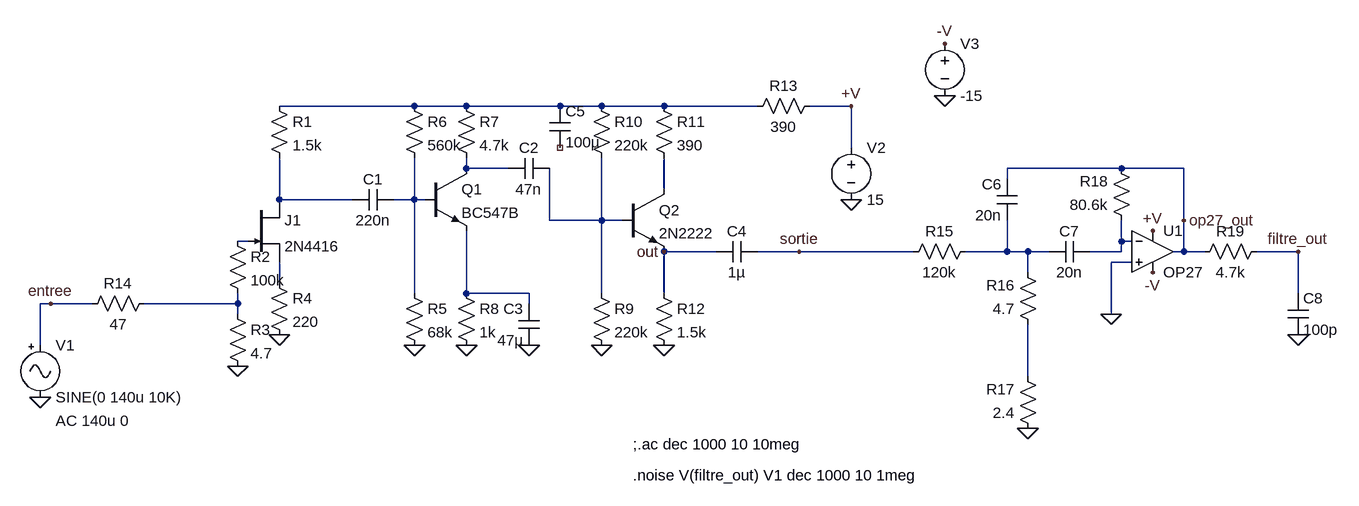
[diagram p0: schematic TP4Elec2.asc]
TP4Elec2.asc, the LTspice schematic file:
Version 4
SHEET 1 1640 680
WIRE 208 0 0 0
WIRE 288 0 208 0
WIRE 432 0 288 0
WIRE 496 0 432 0
WIRE 592 0 496 0
WIRE 736 0 592 0
WIRE 880 0 816 0
WIRE 880 64 880 0
WIRE 288 96 288 80
WIRE 352 96 288 96
WIRE 1296 96 1120 96
WIRE 1392 96 1296 96
WIRE 1120 112 1120 96
WIRE 592 128 592 80
WIRE 0 144 0 80
WIRE 112 144 0 144
WIRE 208 144 208 80
WIRE 208 144 176 144
WIRE 224 144 208 144
WIRE 416 176 416 96
WIRE 496 176 496 80
WIRE 496 176 416 176
WIRE 528 176 496 176
WIRE 1392 176 1392 96
WIRE -48 208 -64 208
WIRE 1296 208 1296 176
WIRE 1312 208 1296 208
WIRE 672 224 592 224
WIRE 800 224 736 224
WIRE 976 224 800 224
WIRE 1120 224 1120 176
WIRE 1120 224 1056 224
WIRE 1152 224 1120 224
WIRE 1184 224 1152 224
WIRE 1296 224 1296 208
WIRE 1296 224 1248 224
WIRE 1392 224 1392 176
WIRE 1392 224 1376 224
WIRE 1424 224 1392 224
WIRE 1568 224 1504 224
WIRE 1312 240 1280 240
WIRE 1152 256 1152 224
WIRE 0 272 0 240
WIRE 208 288 208 144
WIRE 288 288 288 192
WIRE 384 288 288 288
WIRE 496 288 496 176
WIRE 592 288 592 224
WIRE 1568 288 1568 224
WIRE -352 304 -368 304
WIRE -288 304 -352 304
WIRE -64 304 -64 288
WIRE -64 304 -208 304
WIRE 384 304 384 288
WIRE -64 320 -64 304
WIRE 1280 320 1280 240
WIRE -368 368 -368 304
WIRE 1152 416 1152 336
FLAG -368 448 0
FLAG -64 400 0
FLAG 0 352 0
FLAG 208 368 0
FLAG 288 368 0
FLAG 384 368 0
FLAG 496 368 0
FLAG 592 368 0
FLAG 880 144 0
FLAG -352 304 entree
FLAG 800 224 sortie
FLAG 592 224 out
FLAG 1280 320 0
FLAG 1152 496 0
FLAG 1568 352 0
FLAG 1024 -16 0
FLAG 1024 -96 -V
FLAG 880 0 +V
FLAG 1568 224 filtre_out
FLAG 1392 176 op27_out
FLAG 1344 256 -V
FLAG 1344 192 +V
SYMBOL res -16 -16 R0
SYMATTR InstName R1
SYMATTR Value 1.5k
SYMBOL res -80 192 R0
SYMATTR InstName R2
SYMATTR Value 100k
SYMBOL res -80 304 R0
SYMATTR InstName R3
SYMATTR Value 4.7
SYMBOL res -16 256 R0
SYMATTR InstName R4
SYMATTR Value 220
SYMBOL res 192 272 R0
SYMATTR InstName R5
SYMATTR Value 68k
SYMBOL res 192 -16 R0
SYMATTR InstName R6
SYMATTR Value 560k
SYMBOL res 272 -16 R0
SYMATTR InstName R7
SYMATTR Value 4.7k
SYMBOL res 272 272 R0
SYMATTR InstName R8
SYMATTR Value 1k
SYMBOL res 480 272 R0
SYMATTR InstName R9
SYMATTR Value 220k
SYMBOL res 480 -16 R0
SYMATTR InstName R10
SYMATTR Value 220k
SYMBOL res 576 -16 R0
SYMATTR InstName R11
SYMATTR Value 390
SYMBOL res 576 272 R0
SYMATTR InstName R12
SYMATTR Value 1.5k
SYMBOL res 832 -16 R90
WINDOW 0 0 56 VBottom 2
WINDOW 3 32 56 VTop 2
SYMATTR InstName R13
SYMATTR Value 390
SYMBOL res -192 288 R90
WINDOW 0 0 56 VBottom 2
WINDOW 3 32 56 VTop 2
SYMATTR InstName R14
SYMATTR Value 47
SYMBOL cap 176 128 R90
WINDOW 0 0 32 VBottom 2
WINDOW 3 32 32 VTop 2
SYMATTR InstName C1
SYMATTR Value 220n
SYMBOL cap 416 80 R90
WINDOW 0 0 32 VBottom 2
WINDOW 3 32 32 VTop 2
SYMATTR InstName C2
SYMATTR Value 47n
SYMBOL cap 400 368 R180
WINDOW 0 24 56 Left 2
WINDOW 3 24 8 Left 2
SYMATTR InstName C3
SYMATTR Value 47µ
SYMBOL cap 672 240 R270
WINDOW 0 32 32 VTop 2
WINDOW 3 0 32 VBottom 2
SYMATTR InstName C4
SYMATTR Value 1µ
SYMBOL cap 416 0 R0
SYMATTR InstName C5
SYMATTR Value 100µ
SYMBOL Misc\\signal -368 352 R0
WINDOW 123 24 132 Left 2
WINDOW 39 0 0 Left 0
SYMATTR InstName V1
SYMATTR Value SINE(0 140u 10K)
SYMATTR Value2 AC 140u 0
SYMBOL voltage 880 48 R0
WINDOW 123 0 0 Left 0
WINDOW 39 0 0 Left 0
SYMATTR InstName V2
SYMATTR Value 15
SYMBOL njf -48 144 R0
SYMATTR InstName J1
SYMATTR Value 2N4416
SYMBOL npn 224 96 R0
SYMATTR InstName Q1
SYMATTR Value BC547B
SYMBOL npn 528 128 R0
SYMATTR InstName Q2
SYMATTR Value 2N2222
SYMBOL res 1072 208 R90
WINDOW 0 0 56 VBottom 2
WINDOW 3 32 56 VTop 2
SYMATTR InstName R15
SYMATTR Value 120k
SYMBOL res 1168 352 R180
WINDOW 0 36 76 Left 2
WINDOW 3 36 40 Left 2
SYMATTR InstName R16
SYMATTR Value 4.7
SYMBOL res 1168 512 R180
WINDOW 0 36 76 Left 2
WINDOW 3 36 40 Left 2
SYMATTR InstName R17
SYMATTR Value 2.4
SYMBOL res 1312 192 R180
WINDOW 0 36 76 Left 2
WINDOW 3 36 40 Left 2
SYMATTR InstName R18
SYMATTR Value 80.6k
SYMBOL res 1408 240 R270
WINDOW 0 32 56 VTop 2
WINDOW 3 0 56 VBottom 2
SYMATTR InstName R19
SYMATTR Value 4.7k
SYMBOL cap 1136 176 R180
WINDOW 0 24 56 Left 2
WINDOW 3 24 8 Left 2
SYMATTR InstName C6
SYMATTR Value 20n
SYMBOL cap 1184 240 R270
WINDOW 0 32 32 VTop 2
WINDOW 3 0 32 VBottom 2
SYMATTR InstName C7
SYMATTR Value 20n
SYMBOL cap 1552 288 R0
SYMATTR InstName C8
SYMATTR Value 100p
SYMBOL OpAmps\\OP27 1344 160 R0
SYMATTR InstName U1
SYMBOL voltage 1024 -112 R0
WINDOW 123 0 0 Left 0
WINDOW 39 0 0 Left 0
SYMATTR InstName V3
SYMATTR Value -15
TEXT 544 520 Left 2 !;.ac dec 1000 10 10meg
TEXT 544 568 Left 2 !.noise V(filtre_out) V1 dec 1000 10 1meg

The netlist it stands for:
* TP4Elec2.asc
R1 N001 N004 1.5k
R2 N007 N012 100k
R3 N012 0 4.7
R4 N010 0 220
R5 N005 0 68k
R6 N001 N005 560k
R7 N001 N002 4.7k
R8 N011 0 1k
R9 N006 0 220k
R10 N001 N006 220k
R11 N001 N003 390
R12 out 0 1.5k
R13 +V N001 390
R14 N012 entree 47
C1 N005 N004 220n
C2 N006 N002 47n
C3 0 N011 47µ
C4 out sortie 1µ
C5 N001 NC_01 100µ
V1 entree 0 SINE(0 140u 10K) AC 140u 0
V2 +V 0 15
J1 N004 N007 N010 2N4416
Q1 N002 N005 N011 0 BC547B
Q2 N003 N006 out 0 2N2222
R15 N009 sortie 120k
R16 N013 N009 4.7
R17 0 N013 2.4
R18 N008 op27_out 80.6k
R19 op27_out filtre_out 4.7k
C6 N009 op27_out 20n
C7 N009 N008 20n
C8 filtre_out 0 100p
XU1 0 N008 +V -V op27_out OP27  ; pins In+ In- V+ V- OUT
V3 -V 0 -15
.model NPN NPN
.model PNP PNP
.lib standard.bjt
.model NJF NJF
.model PJF PJF
.lib standard.jft
;.ac dec 1000 10 10meg
.noise V(filtre_out) V1 dec 1000 10 1meg
.lib ADI.lib
.backanno
.end